# EAGLE design POSCON.PCB (EAGLE 6.5.0)
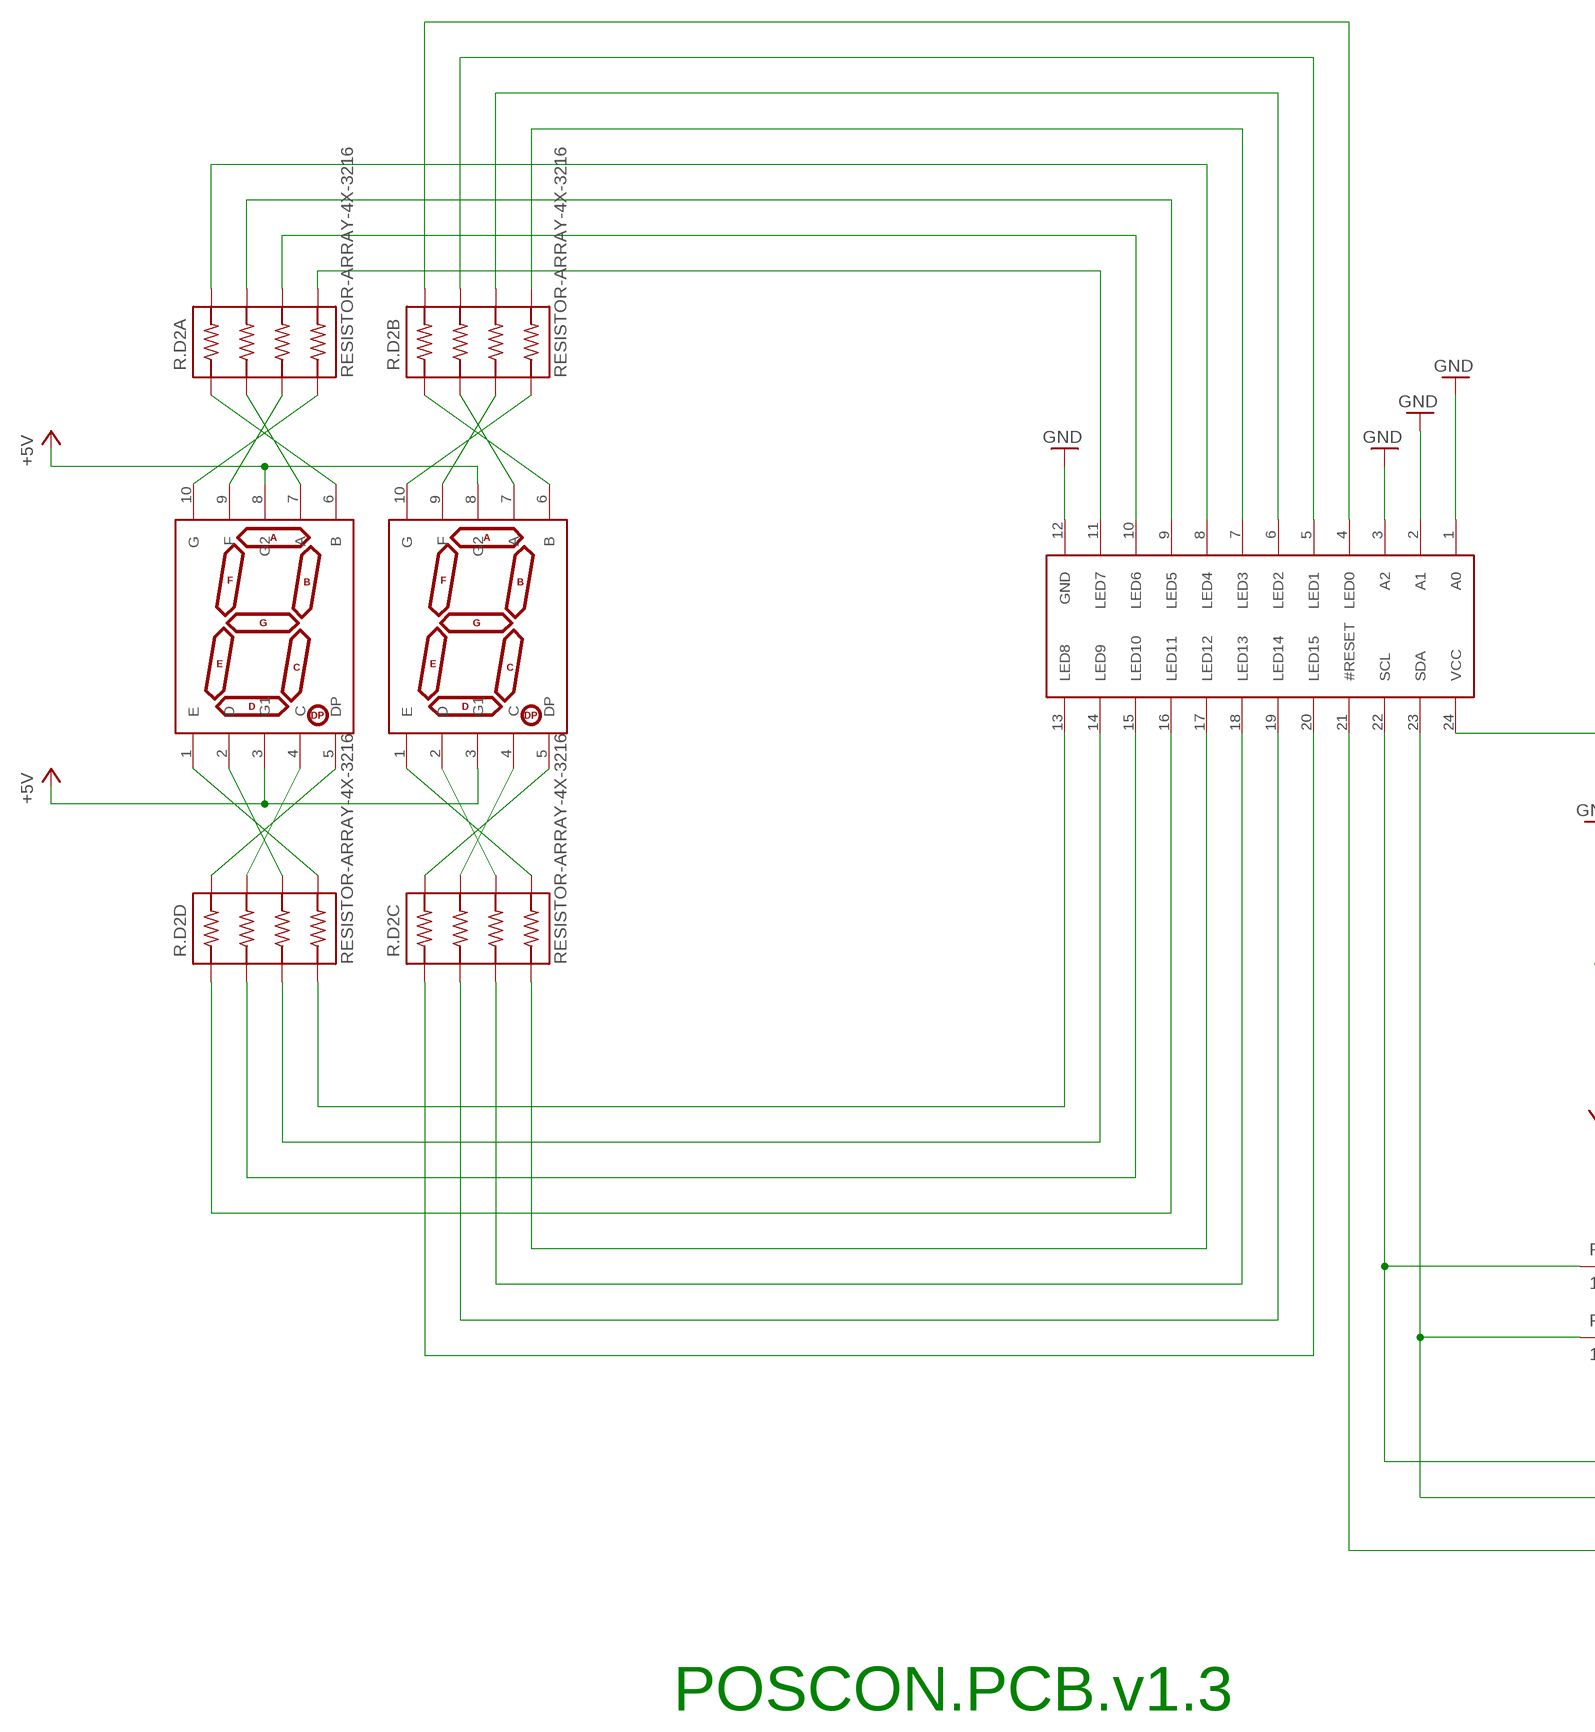
[diagram p0: schematic, sheet 1, part 1 of 2]
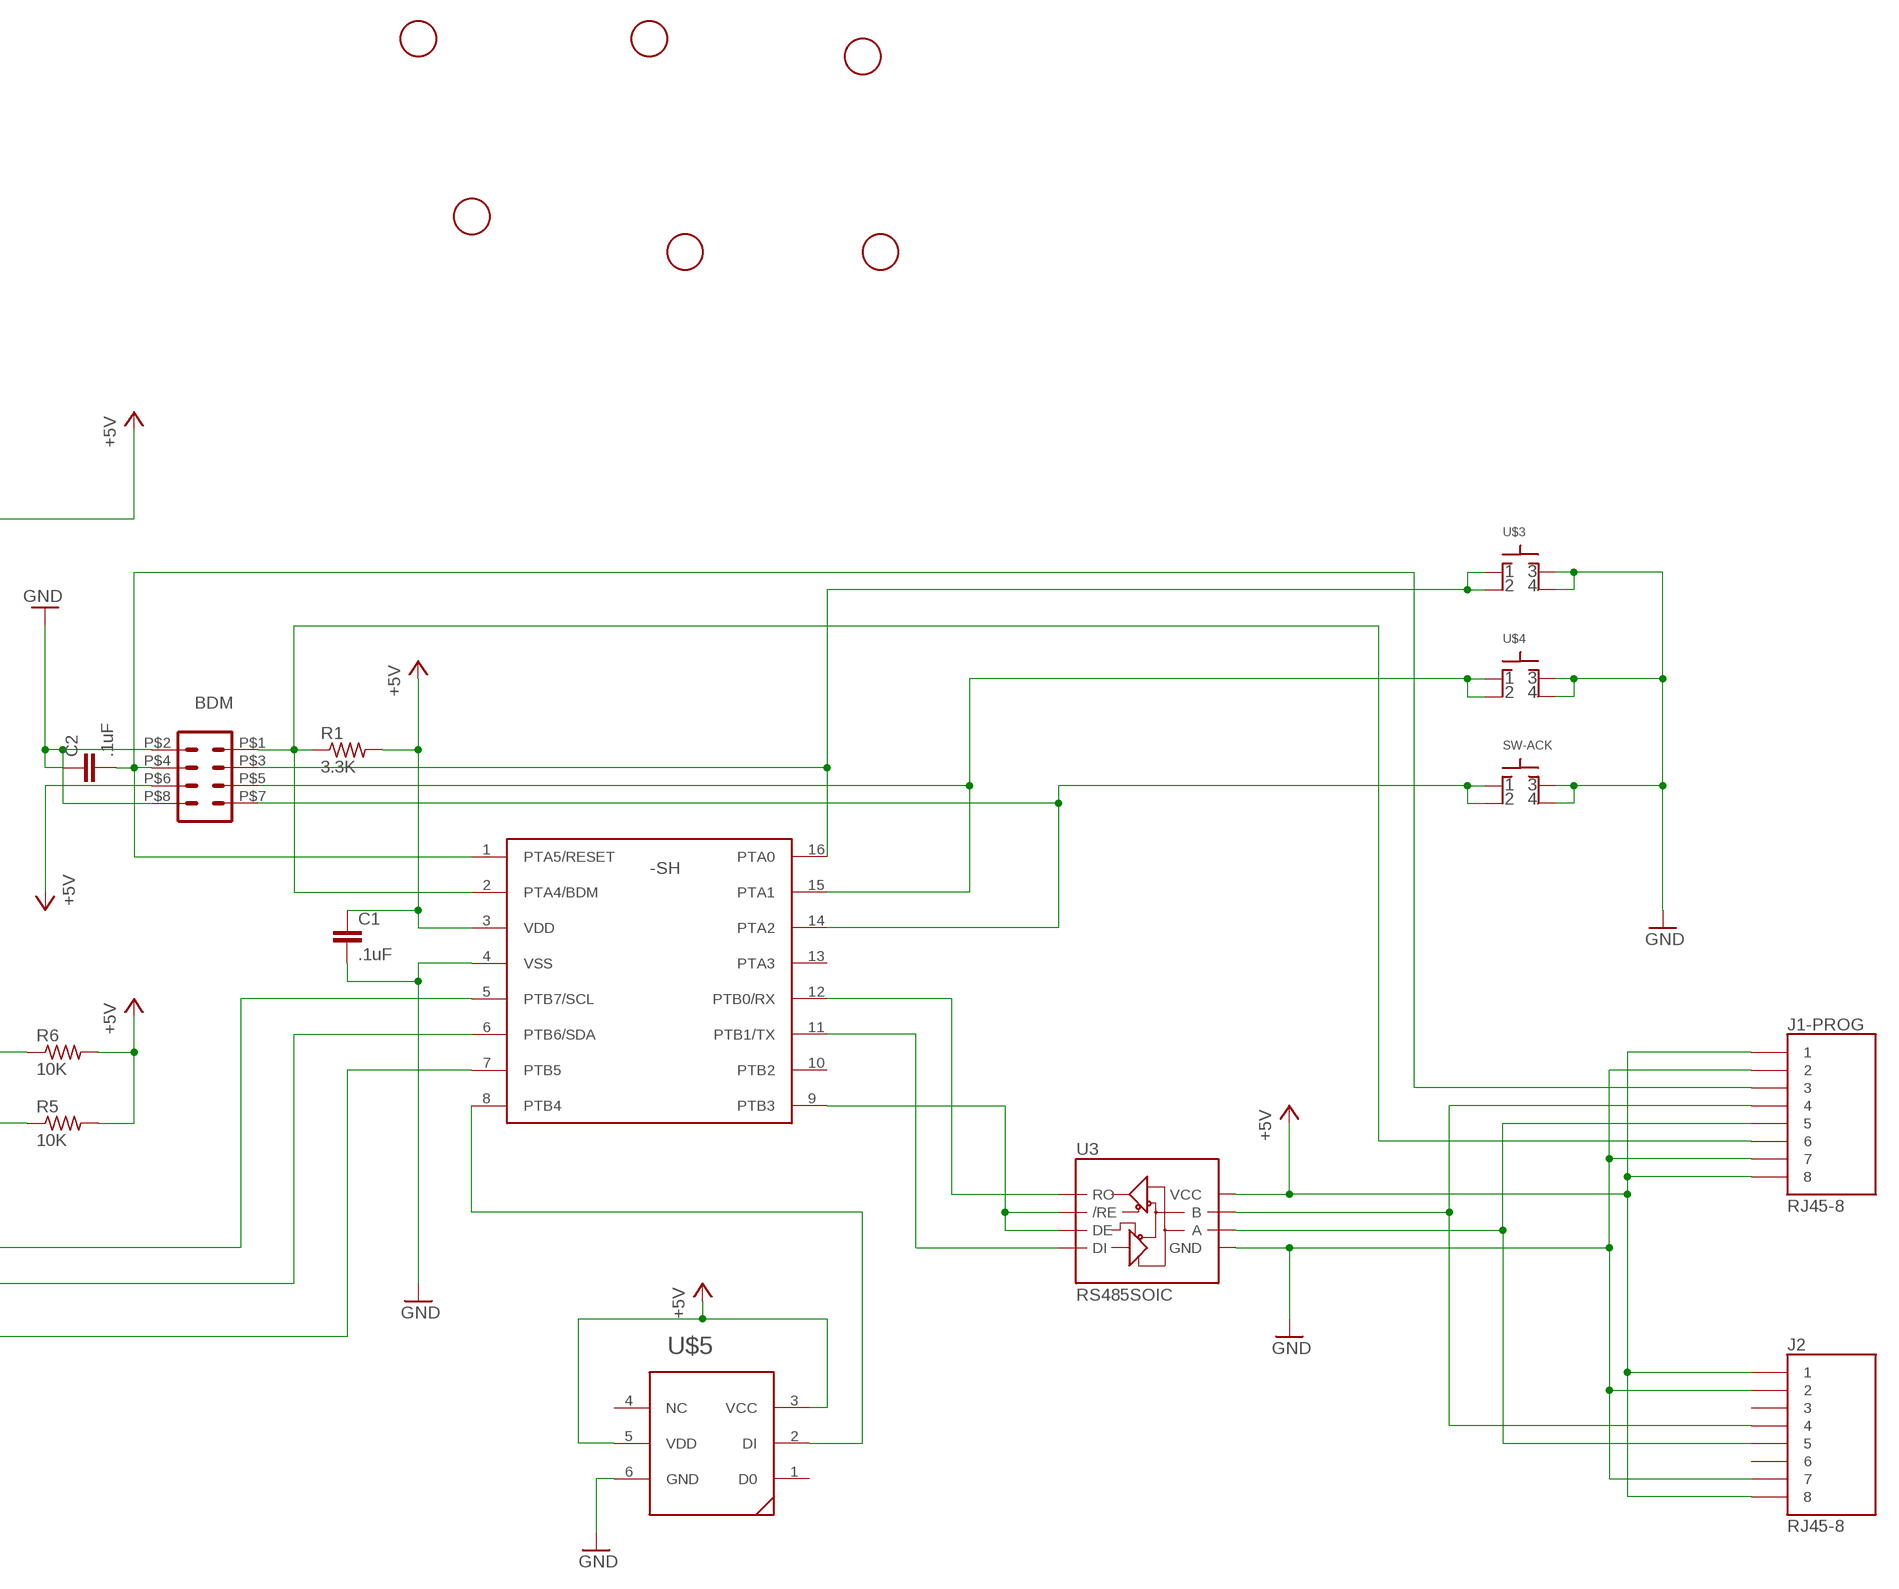
[diagram p1: schematic, sheet 1, part 2 of 2]

## Parts
BDM  TP2X4SMD  [SMD4X2]
C1  .1uF  RF-C0402  [C0402]
C2  .1uF  RF-C0402  [C0402]
J1-PROG  RJ45-8  [RJ45_SMD]
J2  RJ45-8  [RJ45_SMD]
LED1  7SEGMENT-1DIGITSMD  [7SEGMENT-1DIG-.40-SMD]
LED2  7SEGMENT-1DIGITSMD  [7SEGMENT-1DIG-.40-SMD]
R1  3.3K  RF-R0402  [RF-R0402]
R5  10K  RF-R0402  [RF-R0402]
R6  10K  RF-R0402  [RF-R0402]
R.D2A  RESISTOR-ARRAY-4X-3216  [3216-4X]
R.D2B  RESISTOR-ARRAY-4X-3216  [3216-4X]
R.D2C  RESISTOR-ARRAY-4X-3216  [3216-4X]
R.D2D  RESISTOR-ARRAY-4X-3216  [3216-4X]
SW-ACK  SWITCH-TACTILE-320.01E11WHT  [SWITCH-TACTILE-320.01E11WHT]
U1  MC9S08SH8CTG  [TSSOP16]
U3  RS485SOIC  [SO08]
U4  PCA9552  [TSSOP24]
U$1  FIDUCIAL  [FIDUCIAL_1MM]
U$2  FIDUCIAL  [FIDUCIAL_1MM]
U$3  SWITCH-TACTILE  [ESWITCH-TL3301PF]
U$4  SWITCH-TACTILE  [ESWITCH-TL3301PF]
U$5  WS2812  [PLCC-6]
U$6  FIDUCIAL  [FIDUCIAL_1MM]
U$7  FIDUCIAL  [FIDUCIAL_1MM]
U$8  FIDUCIAL  [FIDUCIAL_1MM]
U$9  FIDUCIAL  [FIDUCIAL_1MM]

## Nets
485_N: J1-PROG.P$4 J2.P$4 U3.7(B)
485_P: J1-PROG.P$5 J2.P$5 U3.6(A)
+5V [+3V3]: BDM.P$6 C1.1 J1-PROG.P$1 J1-PROG.P$8 J2.P$1 J2.P$8 LED1.3(G1) LED1.8(G2) LED2.3(G1) LED2.8(G2) R1.2 R5.2 R6.2 U1.3(VDD) U3.8(VCC) U4.24(VCC) U$5.3(VCC) U$5.5(VDD)
ACK: BDM.P$7 SW-ACK.P$1 SW-ACK.P$2 U1.14(PTA2)
BDM: BDM.P$1 J1-PROG.P$6 R1.1 U1.2(PTA4/BDM)
DIR: U1.9(PTB3) U3.2(/RE) U3.3(DE)
GND [GND]: BDM.P$2 BDM.P$8 C1.2 C2.1 J1-PROG.P$2 J1-PROG.P$7 J2.P$2 J2.P$7 SW-ACK.P$3 SW-ACK.P$4 U1.4(VSS) U3.5(GND) U4.1(A0) U4.2(A1) U4.3(A2) U4.12(GND) U$3.3 U$3.4 U$4.3 U$4.4 U$5.6(GND)
INC_DOWN: BDM.P$3 U1.16(PTA0) U$3.1 U$3.2
INC_UP: BDM.P$5 U1.15(PTA1) U$4.1 U$4.2
LED_DI: U1.8(PTB4) U$5.2(DI)
N$2: R.D2A.5(4B) U4.11(LED7)
N$8: R.D2A.6(3B) U4.10(LED6)
N$10: R.D2A.7(2B) U4.9(LED5)
N$11: R.D2A.8(1B) U4.8(LED4)
N$12: R.D2B.5(4B) U4.7(LED3)
N$13: R.D2B.6(3B) U4.6(LED2)
N$14: R.D2B.7(2B) U4.5(LED1)
N$15: R.D2B.8(1B) U4.4(LED0)
N$16: LED2.6(B) R.D2A.1(1A)
N$17: LED2.7(A) R.D2A.2(2A)
N$18: LED2.9(F) R.D2A.3(3A)
N$20: LED2.10(G) R.D2A.4(4A)
N$21: LED2.5(DP) R.D2D.8(1B)
N$22: LED2.4(C) R.D2D.7(2B)
N$24: LED2.2(D) R.D2D.6(3B)
N$25: LED2.1(E) R.D2D.5(4B)
N$26: LED1.6(B) R.D2B.1(1A)
N$27: LED1.7(A) R.D2B.2(2A)
N$28: LED1.9(F) R.D2B.3(3A)
N$29: LED1.10(G) R.D2B.4(4A)
N$30: LED1.5(DP) R.D2C.8(1B)
N$31: R.D2D.4(4A) U4.13(LED8)
N$32: R.D2D.3(3A) U4.14(LED9)
N$33: R.D2D.2(2A) U4.15(LED10)
N$34: R.D2D.1(1A) U4.16(LED11)
N$35: R.D2C.4(4A) U4.17(LED12)
N$36: R.D2C.3(3A) U4.18(LED13)
N$37: R.D2C.2(2A) U4.19(LED14)
N$38: R.D2C.1(1A) U4.20(LED15)
N$39: LED1.4(C) R.D2C.7(2B)
N$40: LED1.2(D) R.D2C.6(3B)
N$41: LED1.1(E) R.D2C.5(4B)
RESET: U1.7(PTB5) U4.21(#RESET)
RST: BDM.P$4 C2.2 J1-PROG.P$3 U1.1(PTA5/RESET)
RX: U1.12(PTB0/RX) U3.1(RO)
SCL: R6.1 U1.5(PTB7/SCL) U4.22(SCL)
SDA: R5.1 U1.6(PTB6/SDA) U4.23(SDA)
TX: U1.11(PTB1/TX) U3.4(DI)
Unconnected: J2.P$3 J2.P$6 U1.10(PTB2) U1.13(PTA3) U$5.1(D0) U$5.4(NC)

## Notes on the sheet
- POSCON.PCB.v1.3

## Library data of the parts
BDM = GW-devices:TP2X4SMD; NOTES: DNP
C1 C2 = GW-devices:RF-C: RF capacitor pads for FSL reference design; MFGN: Murata; MFGP: GRM155R61A104KA01D; PRICE: 0.02
J1-PROG J2 = GW-devices:RJ45-8: RJ45 Jack MFG part number 54602-908lf; MFGN: Molex; MFGP: 0955016889; PRICE: 0.89
LED1 LED2 = GW-devices:7SEGMENT-1DIGIT; MFGN: Kingbright; MFGP: ACSA04-41SEKWA-F01
R1 = GW-devices:RF-R: RF resistor pads for FSL reference design; MFGN: Panasonic; MFGP: ERJ-2GEJ332X; PRICE: 0.02
R5 R6 = GW-devices:RF-R: RF resistor pads for FSL reference design; MFGN: Panasonic; MFGP: ERJ-2GEJ103X; PRICE: 0.02
R.D2A R.D2B R.D2C R.D2D = GW-devices:RESISTOR-ARRAY-4X; MFGN: Yageo; MFGP: YC164-JR-07620RL; PRICE: 0.006
SW-ACK = GW-devices:SWITCH-TACTILE; MFGN: ESwitch; MFGP: 320.01E11WHT
U1 = GW-devices:MC9S08SH8CTG; MFGN: Freescale; MFGP: MC9S08SH8CTG; PRICE: 2.00
U3 = SparkFun:RS485; MFGN: TI; MFGP: SN65HVD1781DR; PRICE: 4.29
U4 = GW-devices:PCA9552; MFGN: NXP; MFGP: PCA9552PW,112; PRICE: 2.67
U$1 U$2 U$6-U$9 = adafruit:FIDUCIAL: For use by pick and place machines to calibrate the vision/machine, 1mm By microbuilder.eu; NOTES: DNP
U$3 U$4 = GW-devices:SWITCH-TACTILE; MFGN: E-Switch; MFGP: TL3301PF160QG
U$5 = GW-devices:WS2812; MFGN: Worldsemi; MFGP: WS2812S

## Board
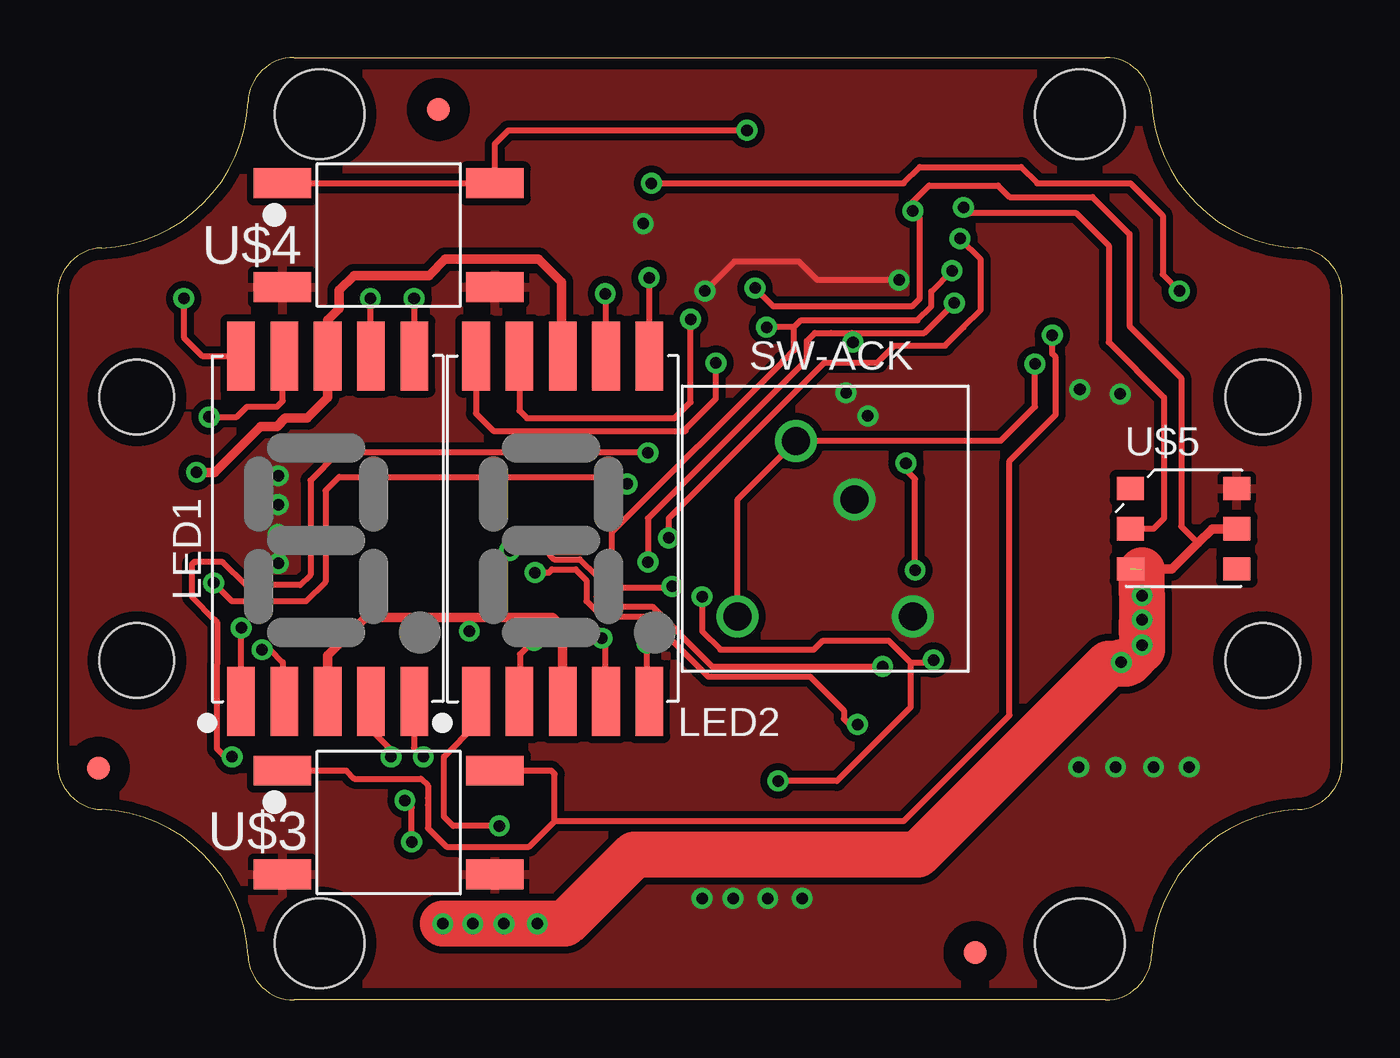
[diagram p2: board, top side]
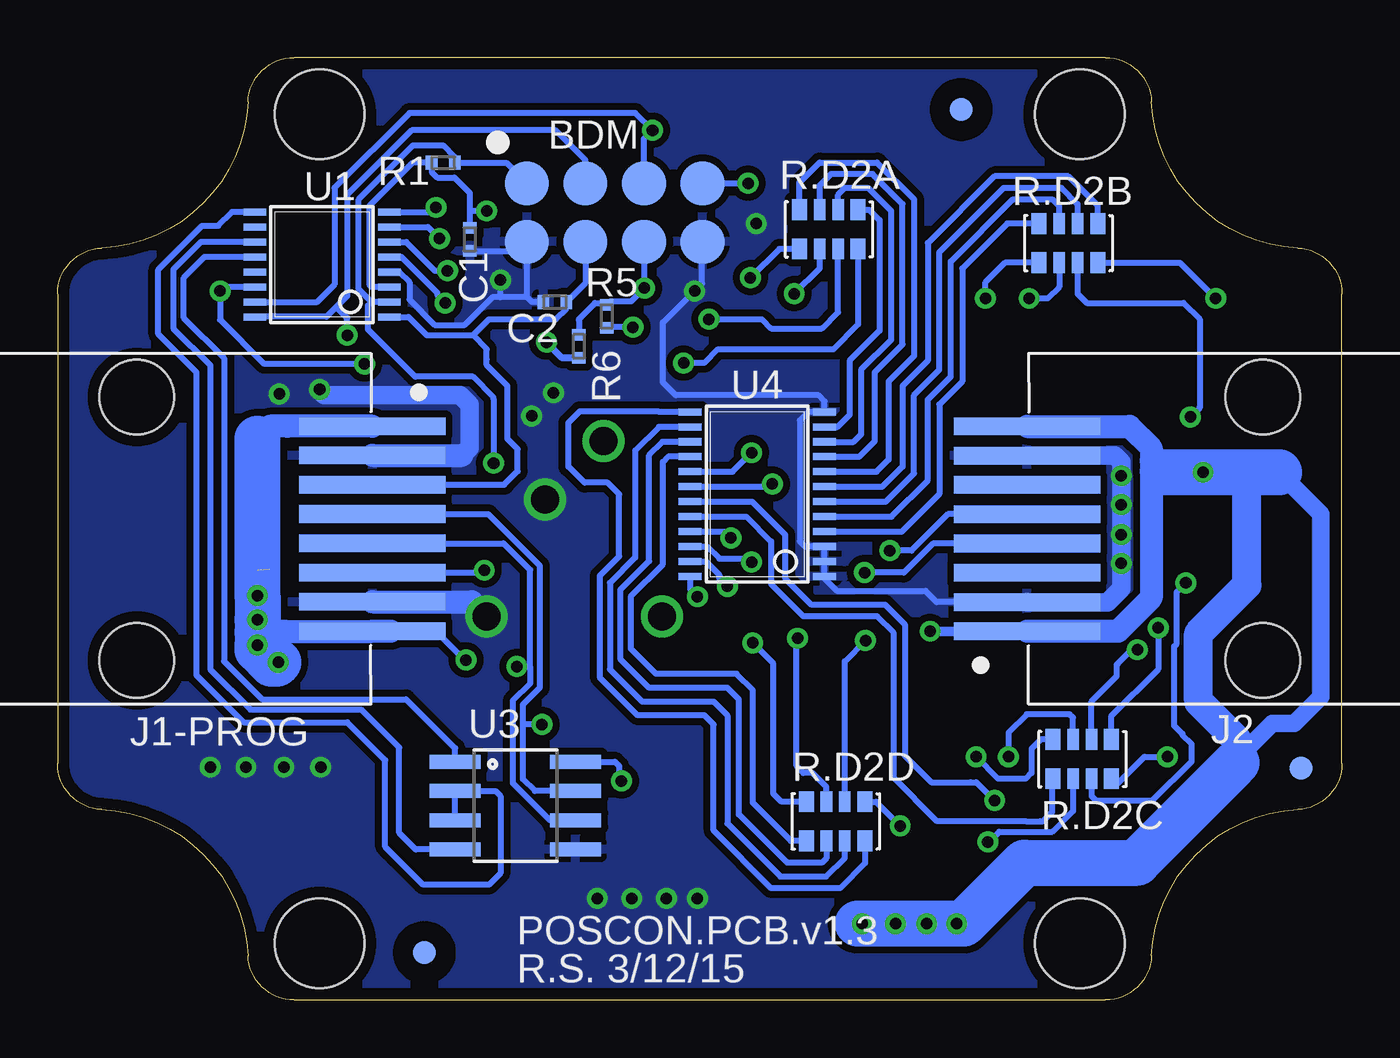
[diagram p3: board, bottom side, seen from below]

Size 55.75 x 40.91 mm. Coordinates in mm from the lower left corner, seen from the top.
Outline: 47.49,38.99 arc88 45.49,40.91 10.26,40.91 arc88 8.26,38.99 arc-85 1.91,32.65 arc88 0,30.65 0,10.26 arc88 1.91,8.26 arc-85 8.26,1.91 arc88 10.26,0 45.49,0 arc88 47.49,1.91 arc-85 53.84,8.26 arc88 55.75,10.26 55.75,30.65 arc88 53.84,32.65 arc-85 47.49,38.99
Copper layers (1*16): Top 0.0356mm / dielectric 1.5011mm / Bottom 0.0356mm
Design rules "SilverCircuits *": minimum track width 7mil, minimum drill 14mil, track to track 7mil, track to pad 7mil, pad to pad 7mil, via to via 7mil, smd to smd 0mil, copper to edge 20mil, drill to drill 7mil, minimum pad ring 10mil, minimum via ring 8mil, stop-mask expansion 4mil, vias tented up to drill 0.5mm, thermal gap 10mil
Holes 3.9 mm at 11.38,38.45 11.38,2.45 44.38,38.45 44.38,2.45

### Footprints (pad centres in the part's own frame; a part is rotated, then mirrored left to right if it is on the bottom)
SMD4X2 = smd 1.905 x 1.905: P$1 0,0; P$2 0,-2.54; P$3 2.54,0; P$4 2.54,-2.54; P$5 5.08,0; P$6 5.08,-2.54; P$7 7.62,0; P$8 7.62,-2.54
C0402 = smd 0.5 x 0.6: 1 -0.5,0; 2 0.5,0
RJ45_SMD = smd 0.76 x 6.35: P$1 -4.45,10.225; P$2 -3.18,10.225; P$3 -1.91,10.225; P$4 -0.64,10.225; P$5 0.63,10.225; P$6 1.905,10.225; P$7 3.175,10.225; P$8 4.445,10.225 | hole 3.25: -5.715,0; 5.715,0
7SEGMENT-1DIG-.40-SMD = smd 1.2 x 3: 1 -3.76,-7.5; 2 -1.88,-7.5; 3 0,-7.5; 4 1.88,-7.5; 5 3.76,-7.5; 6 3.76,7.5; 7 1.88,7.5; 8 0,7.5; 9 -1.88,7.5; 10 -3.76,7.5
RF-R0402 = smd 0.5 x 0.6: 1 -0.5,0; 2 0.5,0
3216-4X = smd 0.65 x 0.9: 1 -1.275,-0.85; 4 1.275,-0.85; 5 1.275,0.85; 8 -1.275,0.85 | smd 0.5 x 0.9: 2 -0.4,-0.85; 3 0.4,-0.85; 6 0.4,0.85; 7 -0.4,0.85
SWITCH-TACTILE-320.01E11WHT = drill 1.22: P$1 -3.81,-3.81; P$2 -1.27,3.81; P$3 1.27,1.27; P$4 3.81,-3.81
TSSOP16 = smd 0.305 x 0.991: 1 -2.275,-2.918; 2 -1.625,-2.918; 3 -0.975,-2.918; 4 -0.325,-2.918; 5 0.325,-2.918; 6 0.975,-2.918; 7 1.625,-2.918; 8 2.275,-2.918; 9 2.275,2.918; 10 1.625,2.918; 11 0.975,2.918; 12 0.325,2.918; 13 -0.325,2.918; 14 -0.975,2.918; 15 -1.625,2.918; 16 -2.275,2.918
SO08 = smd 0.61 x 2.21: 1 -1.905,-2.616; 2 -0.635,-2.616; 3 0.635,-2.616; 4 1.905,-2.616; 5 1.905,2.616; 6 0.635,2.616; 7 -0.635,2.616; 8 -1.905,2.616
TSSOP24 = smd 0.305 x 0.991: 1 -3.575,-2.918; 2 -2.925,-2.918; 3 -2.275,-2.918; 4 -1.625,-2.918; 5 -0.975,-2.918; 6 -0.325,-2.918; 7 0.325,-2.918; 8 0.975,-2.918; 9 1.625,-2.918; 10 2.275,-2.918; 11 2.925,-2.918; 12 3.575,-2.918; 13 3.575,2.918; 14 2.925,2.918; 15 2.275,2.918; 16 1.625,2.918; 17 0.975,2.918; 18 0.325,2.918; 19 -0.325,2.918; 20 -0.975,2.918; 21 -1.625,2.918; 22 -2.275,2.918; 23 -2.925,2.918; 24 -3.575,2.918
FIDUCIAL_1MM = smd 1 x 1: 1 0,0
ESWITCH-TL3301PF = smd 2.5 x 1.3: 1 -4.61,2.25; 2 4.61,2.25; 3 -4.61,-2.25; 4 4.61,-2.25
PLCC-6 = smd 1.18 x 1: 1 -2.31,1.75; 2 -2.31,0; 3 -2.31,-1.75; 4 2.31,-1.75; 5 2.31,0; 6 2.31,1.75

### Placement (x,y rotation side)
BDM  35.38,35.45 0 bottom
C1  37.86,33.02 270 bottom
C2  34.16,30.29 0 bottom
J1-PROG  52.31,20.45 270 bottom
J2  3.44,20.45 90 bottom
LED1  11.73,20.45 0 top
LED2  21.93,20.45 0 top
R1  39.02,36.34 180 bottom
R5  31.91,29.67 90 bottom
R6  33.12,28.38 90 bottom
R.D2A  22.27,33.45 0 bottom
R.D2B  11.88,32.85 0 bottom
R.D2C  11.27,10.45 0 bottom
R.D2D  21.98,7.75 0 bottom
SW-ACK  33.33,20.45 0 top
U1  44.27,31.92 90 bottom
U3  35.88,8.43 270 bottom
U4  25.38,21.95 90 bottom
U$1  1.77,10.05 0 top
U$2  39.83,2.05 0 top
U$3  14.38,7.7 0 top
U$4  14.38,33.2 0 top
U$5  48.88,20.45 0 top
U$6  16.52,38.66 0 top
U$7  1.77,10.05 0 bottom
U$8  39.83,2.05 0 bottom
U$9  16.52,38.66 0 bottom

### Tracks (layer width: path | path; a pad name or v marks a point on that pad's centre or on a via)
485_N  (via drill 0.5)
  Top 0.254: v20.73,18.55 21.32,18.55 21.46,18.69 22.49,18.69 22.96,18.22 22.96,17.32 23.64,16.64 25.64,16.64 27.87,14.4 27.92,14.35 28.02,14.25 28.24,14.04 32.66,14.04 34.12,12.57 34.12,12.2 34.38,11.95 v34.73,11.95
  Bottom 0.254: J1-PROG.P$4 37.06,21.09 34.81,18.84 34.81,13.57 35.56,12.82 35.56,11.95 | 35.56,11.95 35.56,9.59 35.03,9.07 U3.7 | J2.P$4 17.76,19.81 19.02,18.55 v20.73,18.55 | v34.73,11.95 35.56,11.95
485_P  (via drill 0.5)
  Top 0.254: v19.62,19.5 21.18,19.5 21.56,19.12 22.66,19.12 23.39,18.39 23.39,17.49 23.81,17.07 25.81,17.07 28.18,14.71 28.33,14.56 28.38,14.51 28.41,14.47 34.19,14.47 34.2,14.47 v35.81,14.47
  Bottom 0.254: J1-PROG.P$5 36.4,19.82 35.24,18.67 35.24,14.45 | 35.24,14.45 35.24,13.74 35.99,12.99 35.99,9.42 34.38,7.8 U3.6 | J2.P$5 17.1,21.08 18.68,19.5 v19.62,19.5 | v35.81,14.47 35.8,14.45 35.24,14.45
+5V  (via drill 0.5, 0.5 pad 0.25)  (1 unrouted)
  Top 0.254: 30.3,30.92 v30.27,30.9 31.07,30.1 37.08,30.1 37.42,30.45 37.42,33.95 v37.12,34.25 37.12,34.66 37.83,35.35 40.83,35.35 41.33,34.85 44.92,34.85 46.52,33.25 46.52,29.25 48.77,27 48.77,20.55 49.5,19.83 | v27.98,17.5 27.98,16 28.77,15.2 32.83,15.2 33.23,15.6 36.08,15.6 37.02,14.65 | 37.02,14.65 37.02,12.7 33.83,9.5 v31.27,9.5 | 37.02,14.65 37.92,14.65 v38.02,14.75
  Top 0.406: LED2.3 21.93,16.15 21.48,16.6 17.88,16.6 | 17.88,16.6 13.38,16.6 11.73,14.95 LED1.3 | LED2.8 21.88,28 21.88,31.15 20.88,32.16 16.82,32.16 16.12,31.45 12.88,31.45 12.22,30.8 12.22,30 11.73,29.5 LED1.8 11.73,26.25 11.73,26.15 10.82,25.25 9.88,25.25 9.52,24.9 8.82,24.9 6.82,22.9 v6.02,22.9 | U$5.5 50.12,20.45 49.5,19.83 48.38,18.7 U$5.3 | v17.88,16 17.88,16.6
  Top 2: v16.73,3.3 v18.02,3.3 v19.38,3.3 20.68,3.3 22.02,3.3 25.02,6.3 37.33,6.3 45.62,14.6 46.38,14.6 46.42,14.65 | v47.08,16.5 47.08,15.85 v47.08,16.5 | v47.08,16.5 47.08,16.25 | 47.08,18.65 v47.08,17.55 v47.08,16.5 | v47.08,16.5 47.08,15.25 | 47.08,15.25 47.08,15.2 | 47.08,15.2 | 46.42,14.65 v46.17,14.65 46.42,14.65 | 46.42,14.65 46.48,14.65 47.08,15.25 | 46.42,14.65 46.52,14.65 47.08,15.2
  Bottom 0.254: U1.3 42.12,30.95 42.23,31.05 42.23,34.45 40.34,36.34 R1.2 39.52,35.95 39.27,35.7 38.52,35.7 37.86,35.03 C1.1 37.86,34.22 37.83,34.25 v37.12,34.25 | BDM.P$6 30.27,32.89 v30.27,30.9 30.86,30.32 31.76,30.32 R5.2 31.99,30.25 32.42,30.25 33.12,29.55 33.12,29.5 R6.2 | 8.27,23.4 8.27,22.95 | U4.24 28.29,17.82 v27.98,17.5 | v38.02,14.75 38.08,14.75 39.33,16 41.27,16 | J1-PROG.P$8 | U3.8 31.56,10.34 31.38,10.15 31.38,9.6 v31.27,9.5
  Bottom 0.406: J2.P$1 v17.88,16 | 47.08,15.2 v47.08,15.4 | 46.12,15.95 47.08,15.95 | v20.82,3.3 20.88,3.3
  Bottom 0.75: 4.52,10.5 3.02,12 2.07,12 0.93,13.15 0.93,21.1 2.62,22.8 2.73,22.9
  Bottom 0.813: J1-PROG.P$8 | 46.62,16 46.08,16 46.12,15.95
  Bottom 1: J1-PROG.P$1 45.77,24.9 46.52,24.9 46.58,24.85 47.08,24.35 | J1-PROG.P$8 45.88,16 46.08,16 | J2.P$8 9.22,24.9 8.27,23.95 8.27,23.4 | 8.27,23.4 8.27,22.95 8.27,17.45 9.73,16 J2.P$1 | 8.27,23.4 6.18,23.4 6.18,22.9 v6.02,22.9 6.02,22.4 8.18,22.4 | 41.27,16 J1-PROG.P$8 | 4.68,10.35 4.68,10.2 4.68,10.3 4.62,10.35 | 4.68,10.35 4.6,10.43 4.52,10.5 | 4.12,22.85 4.23,22.95 | 4.77,10.45 4.68,10.35
  Bottom 1.2: 4.73,10.55 4.6,10.43
  Bottom 1.25: 4.12,22.85 4.12,18 6.23,15.9 6.23,13 6.23,12.95 4.52,11.25 4.52,10.45 4.62,10.35
  Bottom 1.5: 14.6,5.13 14.53,5.2
  Bottom 2: 21.02,3.3 20.88,3.3 v20.82,3.3 v16.73,3.3 16.43,3.3 14.6,5.13 13.78,5.95 8.88,5.95 8.88,6 4.68,10.2 4.57,10.3 | 47.08,24.35 v47.08,17.55 v47.08,16.5 47.08,15.95 v47.08,15.4 | v47.08,15.4 47.08,15.2 | 2.73,22.9 5.98,22.9 v6.02,22.9 | v47.08,15.4 47.08,15.2 | 47.08,15.2 46.48,14.6 46.23,14.6 v46.17,14.65
ACK  (via drill 0.5)
  Top 0.254: SW-ACK.P$1 29.52,21.72 SW-ACK.P$2 40.94,24.26 42.42,25.75 v42.42,27.6 | v25.77,35.45 36.73,35.45 37.42,36.16 41.83,36.16 42.52,35.45 46.58,35.45 47.98,34.05 47.98,31.5 v48.7,30.78
  Bottom 0.254: U1.14 48.53,30.95 v48.7,30.78 48.7,29.53 46.77,27.6 v42.42,27.6 | 26.98,35.45 BDM.P$7 v25.77,35.45
BDM  (via drill 0.5)
  Top 0.254: v37.23,18.65 37.23,22.6 36.83,23 v36.83,23.3
  Bottom 0.254: U1.2 42.12,30.3 | 42.12,30.3 42.67,30.85 42.67,34.75 40.33,37.1 39.02,37.1 38.52,36.59 R1.1 36.27,36.34 BDM.P$1 | J1-PROG.P$6 37.33,18.55 v37.23,18.65 | 42.12,30.3 42.27,30.14 42.27,29.1 40.42,27.25 40.23,27.05 37.73,27.05 36.83,26.15 36.83,26.1 v36.83,23.3
DIR
  Bottom 0.254: U3.3 U3.2 36.74,9.07 36.52,8.85 36.52,5.5 37.02,5 39.88,5 41.52,6.65 41.52,10.4 43.17,12.05 47.67,12.05 49.73,14.1 49.73,27.25 51.38,28.9 51.38,31.7 49.48,33.6 48.77,33.6 48.18,34.2 U1.9
GND  (via drill 0.5)
  Top 0.254: v9.57,22.75 9.57,22.65 | v36.52,31.25 32.98,31.25 32.17,32.05 29.38,32.05 v28.1,30.78
  Bottom 0.254: U1.4 40.92,31.6 40.48,31.15 40.48,30.4 39.38,29.3 38.08,29.3 36.88,30.5 36.52,30.5 | 35.38,30.5 BDM.P$2 35.77,32.52 C1.2 | J2.P$2 17.59,17.27 18.07,17.75 21.93,17.75 22.46,18.29 U4.1 U4.2 U4.3 23.3,19.68 23.52,19.9 23.52,25.15 23.15,25.53 U4.12 22.46,25.99 22.73,26.25 28.93,26.25 29.48,26.8 29.48,29.4 v28.1,30.78 27.77,31.1 27.77,32.89 BDM.P$8 | 9.85,23.63 9.85,23.03 v9.57,22.75 | C2.1 35.16,30.29 35.38,30.5 | 35.38,30.5 36.52,30.5 | 36.52,30.5 v36.52,31.25
  Bottom 0.813: J2.P$7 9.85,23.63 9.57,23.35 v9.57,22.75 9.57,17.85 10.18,17.25 13.64,17.25 J2.P$2 | 38.2,23.63 38.17,23.65 37.88,23.95 37.88,25.85 38.17,26.15 38.27,26.25 38.58,26.25 44.17,26.25 44.38,26.45 | 37.77,17.28 SW-ACK.P$4 37.16,16.64 37.17,16.65
  Bottom 1: J1-PROG.P$7 37.77,17.28 | J1-PROG.P$2 38.2,23.63
  other vias: 9.57,21.5 25.43,33.7 44.38,26.5 46.12,26.3 44.33,10.1 45.92,10.1 9.57,20.2 27.98,4.4 29.32,4.4 30.82,4.4 47.58,10.1 35.17,25.35 34.23,26.35 32.33,4.4 49.12,10.1 9.57,18.95
  pour Top (isolate 0.305): -0.43,41.35 56.58,41.35 56.58,-0.55 -0.43,-0.55
  pour Bottom (isolate 0.305): -0.43,41.35 56.38,41.35 56.38,-0.55 -0.43,-0.55
  pour Top (no thermals): 35.77,17.65 38.17,17.65 38.17,15.75 36.67,15.75 35.77,16.65
INC_DOWN  (via drill 0.5)
  Top 0.254: U$3.1 12.07,9.95 12.43,9.95 12.53,9.95 12.88,9.6 15.78,9.6 16.07,9.3 16.07,8.75 16.07,8.45 16.07,7.45 16.88,6.65 20.48,6.65 21.57,7.75 | v43.17,28.85 43.17,28.05 43.33,27.9 43.33,25.4 41.33,23.4 41.33,12.35 36.73,7.75 21.57,7.75 | 21.57,7.75 21.57,9.8 21.43,9.95 U$3.2
  Bottom 0.254: 43.65,30.08 43.17,30.55 43.17,34.95 40.38,37.75 34.12,37.75 32.84,36.47 BDM.P$3 | 43.65,30.08 44.08,29.65 U1.16 | v43.17,28.85 43.17,29.6 43.65,30.08
INC_UP  (via drill 0.5)
  Top 0.254: U$4.1 U$4.2 18.98,37.16 19.57,37.75 v29.93,37.75
  Bottom 0.254: 30.27,35.47 BDM.P$5 30.3,37.38 v29.93,37.75 30.68,38.5 40.48,38.5 43.73,35.25 43.73,31.05 44.48,30.3 U1.15
LED_DI  (via drill 0.5)
  Top 0.254: U$5.2 47.58,20.45 48.02,20.9 48.02,26.15 45.62,28.55 45.62,32.75 44.23,34.16 39.58,34.16 v39.33,34.41
  Bottom 0.254: U1.8 39.53,34.2 v39.33,34.41
N$2
  Bottom 0.254: R.D2A.5 20.52,34.3 20.07,33.85 20.07,29.05 21.38,27.75 21.38,25.4 21.89,24.88 U4.11
N$8
  Bottom 0.254: R.D2A.6 21.88,34.95 21.57,35.25 20.57,35.25 19.57,34.25 19.57,28.65 20.88,27.35 20.88,24.55 21.2,24.23 U4.10
N$10
  Bottom 0.254: U4.9 20.95,23.58 20.27,24.25 20.27,27.25 19.07,28.45 19.07,34.55 20.38,35.85 22.18,35.85 22.68,35.35 R.D2A.7
N$11
  Bottom 0.254: R.D2A.8 23.55,35.48 22.68,36.35 20.18,36.35 18.57,34.75 18.57,27.95 19.68,26.85 19.68,23.45 20.2,22.93 U4.8
N$12
  Bottom 0.254: R.D2B.5 10.6,34.48 11.88,35.75 15.07,35.75 17.98,32.85 17.98,27.75 19.07,26.65 19.07,23.15 19.95,22.28 U4.7
N$13
  Bottom 0.254: R.D2B.6 11.48,34.55 12.18,35.25 14.68,35.25 17.48,32.45 17.48,27.35 18.57,26.25 18.57,22.85 19.8,21.63 U4.6
N$14
  Bottom 0.254: R.D2B.7 12.28,34.45 12.57,34.75 14.28,34.75 16.98,32.05 16.98,27.05 17.98,26.05 17.98,22.55 19.55,20.98 U4.5
N$15
  Bottom 0.254: R.D2B.8 14.53,33.7 16.48,31.75 16.48,26.85 17.48,25.85 17.48,21.95 19.1,20.33 U4.4
N$16  (via drill 0.5)
  Top 0.254: v25.68,31.35 LED2.6
  Top 0.406: LED2.6
  Bottom 0.254: R.D2A.1 24.43,32.6 v25.68,31.35
N$17  (via drill 0.5)
  Top 0.254: v23.77,30.65 23.77,27.98
  Top 0.406: 23.77,27.98 LED2.7
  Bottom 0.254: R.D2A.2 22.68,31.75 v23.77,30.65
N$18  (via drill 0.5)
  Top 0.254: LED2.9 20.05,25.58 20.38,25.25 26.77,25.25 27.48,25.95 v27.48,29.55
  Bottom 0.254: v27.48,29.55 25.18,29.55 24.77,29.15 22.57,29.15 21.88,29.85 R.D2A.3
N$20  (via drill 0.5)
  Top 0.254: LED2.10 18.16,25.46 18.93,24.7 27.27,24.7 27.27,24.8 28.57,26.1 v28.57,27.65
  Bottom 0.254: R.D2A.4 21,29.33 22.07,28.25 27.07,28.25 27.68,27.65 v28.57,27.65
N$21  (via drill 0.5)
  Top 0.254: v25.57,15.5 25.57,13.06 LED2.5
  Bottom 0.254: R.D2D.8 24.32,8.6 24.68,8.95 24.68,14.6 v25.57,15.5
N$22  (via drill 0.5)
  Top 0.254: LED2.4 23.77,12.98 23.77,15.55 v23.62,15.7
  Bottom 0.254: R.D2D.7 22.38,9.25 22.98,9.85 23.38,9.85 23.68,10.15 23.68,15.65 v23.62,15.7
N$24  (via drill 0.5)
  Top 0.254: LED2.2 20.07,12.98 20.07,15 v20.68,15.6
  Bottom 0.254: R.D2D.6 21.57,14.7 v20.68,15.6
N$25  (via drill 0.5)
  Top 0.254: 18.27,13.06 LED2.1 18.18,11.95 16.77,10.55 16.77,7.95 17.18,7.55 v19.18,7.55
  Bottom 0.254: R.D2D.5 20.23,8.6 v19.18,7.55
N$26  (via drill 0.5)
  Top 0.254: v15.47,30.45 LED1.6
  Bottom 0.254: R.D2B.1 14.62,32 15.47,31.15 v15.47,30.45
N$27  (via drill 0.5)
  Top 0.254: v13.57,30.45 13.57,27.98 LED1.7
  Bottom 0.254: R.D2B.2 12.28,30.95 12.78,30.45 v13.57,30.45
N$28  (via drill 0.5)
  Top 0.254: 9.77,27.88 LED1.9 9.77,27.88 | v6.57,25.3 7.77,25.3 8.23,25.75 9.52,25.75 9.77,26 9.77,27.88
  Bottom 0.254: R.D2B.3 11.48,30.65 11.07,30.25 6.88,30.25 6.18,29.55 6.18,25.75 6.18,25.7 v6.57,25.3
N$29  (via drill 0.5)
  Top 0.254: v5.48,30.45 5.48,28.75 6.27,27.95 LED1.10
  Bottom 0.254: R.D2B.4 7.02,32 v5.48,30.45
N$30  (via drill 0.5)
  Top 0.254: LED1.5 15.47,10.95 v15.88,10.55
  Bottom 0.254: v15.88,10.55 14.93,9.6 14.53,9.6 14.07,9.6 13.72,9.6 13.47,9.85 13.47,10.9 13.07,11.3 R.D2C.8
N$31
  Bottom 0.254: R.D2D.4 20.7,5.93 21.77,4.85 24.77,4.85 27.27,7.35 27.27,11.95 27.68,12.35 30.57,12.35 32.23,14 32.23,18.4 31.38,19.25 31.38,21.95 31.88,22.45 32.88,22.45 33.58,23.15 33.58,25.05 33.08,25.55 29.68,25.55 29.65,25.53 U4.13
N$32
  Bottom 0.254: U4.14 29.65,24.88 30.68,23.85 30.68,19.2 31.77,18.1 31.77,14.35 30.38,12.95 27.27,12.95 26.68,12.35 26.68,7.65 24.38,5.35 22.38,5.35 21.57,6.15 R.D2D.3
N$33
  Bottom 0.254: R.D2D.2 22.38,6.15 22.57,5.95 24.07,5.95 26.18,8.05 26.18,13.05 26.68,13.55 30.07,13.55 31.32,14.8 31.32,17.8 30.07,19.05 30.07,23.65 29.5,24.23 U4.15
N$34
  Bottom 0.254: R.D2D.1 23.93,6.9 25.57,8.55 25.57,13.45 26.27,14.15 29.77,14.15 30.88,15.25 30.88,17.5 29.48,18.9 29.48,23.35 29.25,23.58 U4.16
N$35  (via drill 0.5)
  Top 0.254: v25.62,23.75 12.18,23.75 10.98,22.55 10.98,20.1 10.98,18.45 10.52,18 8.18,18 7.18,19 5.98,19 5.95,19.03 5.82,18.9 5.82,17.5 6.82,16.5 6.93,16.4 6.93,14.55 6.93,10.9 7.27,10.55 v7.57,10.55
  Bottom 0.254: U4.17 26.45,22.93 v25.62,23.75 | R.D2C.4 9.8,9.4 9.73,9.4 8.57,10.55 v7.57,10.55
N$36  (via drill 0.5)
  Top 0.254: v24.73,22.4 24.43,22.7 12.22,22.7 11.62,22.1 11.62,18.15 10.77,17.3 7.57,17.3 v6.77,18.1
  Bottom 0.254: U4.18 24.85,22.28 v24.73,22.4 | R.D2C.3 10.88,8.85 10.68,8.65 8.32,8.65 8.23,8.65 6.52,10.35 6.52,11.1 6.93,11.5 6.93,11.55 7.27,11.9 7.27,15.35 7.18,15.45 7.18,17.7 v6.77,18.1
N$37  (via drill 0.5)
  Top 0.254: v15.38,6.85 15.38,8.35 v15.07,8.65
  Bottom 0.254: U4.19 25.6,21.63 24.18,20.2 24.18,18.3 23.02,17.15 19.82,17.15 18.98,16.3 18.98,10.65 18.98,10.6 17.82,9.45 16.12,9.45 15.88,9.45 v15.07,8.65 | v15.38,6.85 15.28,6.95 15.22,6.95 14.88,7.3 12.57,7.3 11.68,8.2 R.D2C.2
N$38
  Bottom 0.254: U4.20 25.85,20.98 24.77,19.9 24.77,18.05 23.38,16.65 20.18,16.65 19.48,15.95 19.48,9.65 17.6,7.78 17.57,7.75 13.72,7.75 13.1,7.75 12.97,7.75 12.57,8.15 12.57,9.58 R.D2C.1
N$39  (via drill 0.5)
  Top 0.254: 13.57,12.92 LED1.4 13.57,12.98 13.57,13.55 13.57,13.35 13.68,13.25 13.68,11.65 14.47,10.85 v14.47,10.55
  Bottom 0.254: R.D2C.7 11.68,12.25 11.82,12.4 13.68,12.4 14.47,11.6 v14.47,10.55
N$40  (via drill 0.5)
  Top 0.254: v8.88,15.2 9.23,15.2 9.77,14.65 9.77,13.02 LED1.2
  Bottom 0.254: R.D2C.6 10.88,12.95 9.77,14.05 9.77,14.55 9.73,14.6 9.12,15.2 v8.88,15.2
N$41  (via drill 0.5)
  Top 0.254: LED1.1 7.96,14.16 7.96,14.36 7.98,14.35 v7.98,16.15
  Bottom 0.254: R.D2C.5 10.02,11.33 10.02,12.3 7.98,14.35 v7.98,16.15
RESET  (via drill 0.5)
  Top 0.254: 26.52,20.45 v26.52,20.05 26.52,20.9 33.27,27.65 35.62,27.65 35.62,27.7 36.33,28.4 38.52,28.4 39.33,29.2 40.08,29.95 40.08,32.16 v39.17,33.05
  Bottom 0.254: U4.21 26.8,20.33 v26.52,20.05 | U1.7 39.67,33.55 v39.17,33.05
RST
  Bottom 0.254: BDM.P$4 32.84,31.12 C2.2 33.66,30.02 34.12,29.55 37.02,29.55 37.73,28.85 | U1.1 40.52,29.65 39.73,28.85 37.73,28.85 | J1-PROG.P$3 36.37,22.36 35.77,22.95 35.77,23.9 36.23,24.35 36.23,26.65 37.12,27.55 37.12,27.8 37.12,28.25 37.73,28.85
RX
  Bottom 0.254: U3.1 38.49,10.92 40.62,13.05 46.88,13.05 48.52,14.7 48.52,27.85 50.27,29.6 50.27,31.35 49.38,32.25 U1.12
SCL  (via drill 0.5)
  Top 0.254: v25.62,19 25.62,20.9 32.52,27.8 32.52,28.6 32.88,28.95 33.58,28.95 34.48,28.95 | 34.48,28.95 37.62,28.95 v38.92,30.25 | v34.52,28.55 34.52,28.9 34.48,28.95
  Bottom 0.254: U4.22 27.55,19.68 27.02,19.15 25.77,19.15 v25.62,19 | U1.5 40.82,32.25 39.27,30.7 39.27,30.6 v38.92,30.25 | 33.14,27.85 R6.1
  Bottom 0.305: R6.1 33.84,27.88 v34.52,28.55
SDA  (via drill 0.5)
  Top 0.254: 31.52,27.75 24.07,20.3 24.07,18.25 24.43,17.9 26.62,17.9 v26.68,17.95 | 31.52,27.75 31.98,28.2 31.98,29.2 | 31.52,27.75 31.48,27.75 | 31.98,29.2 32.27,29.5 37.33,29.5 37.92,30.1 37.92,30.75 v38.83,31.65 | 31.98,29.2 v30.77,29.2
  Bottom 0.254: U4.23 27.6,19.03 27.02,18.45 27.02,18.3 v26.68,17.95 | U1.6 40.62,32.9 39.38,31.65 v38.83,31.65 | v30.77,29.2 31.88,29.2 R5.1
TX
  Bottom 0.254: U1.11 49.53,32.9 50.73,31.7 50.73,29.15 49.12,27.55 49.12,14.35 47.38,12.6 42.58,12.6 40.92,10.95 40.92,7.25 40.2,6.53 U3.4

### Text on the board
bPlace: POSCON.PCB.v1.3 | R.S. 3/12/15